# Altium schematic sheet LVDS_Splitter.SchDoc
size A3; Organization: Altium Limited; Address1: L3, 12a Rodborough Rd; Address2: Frenchs Forest; Address3: NSW; Address4: Australia 2086
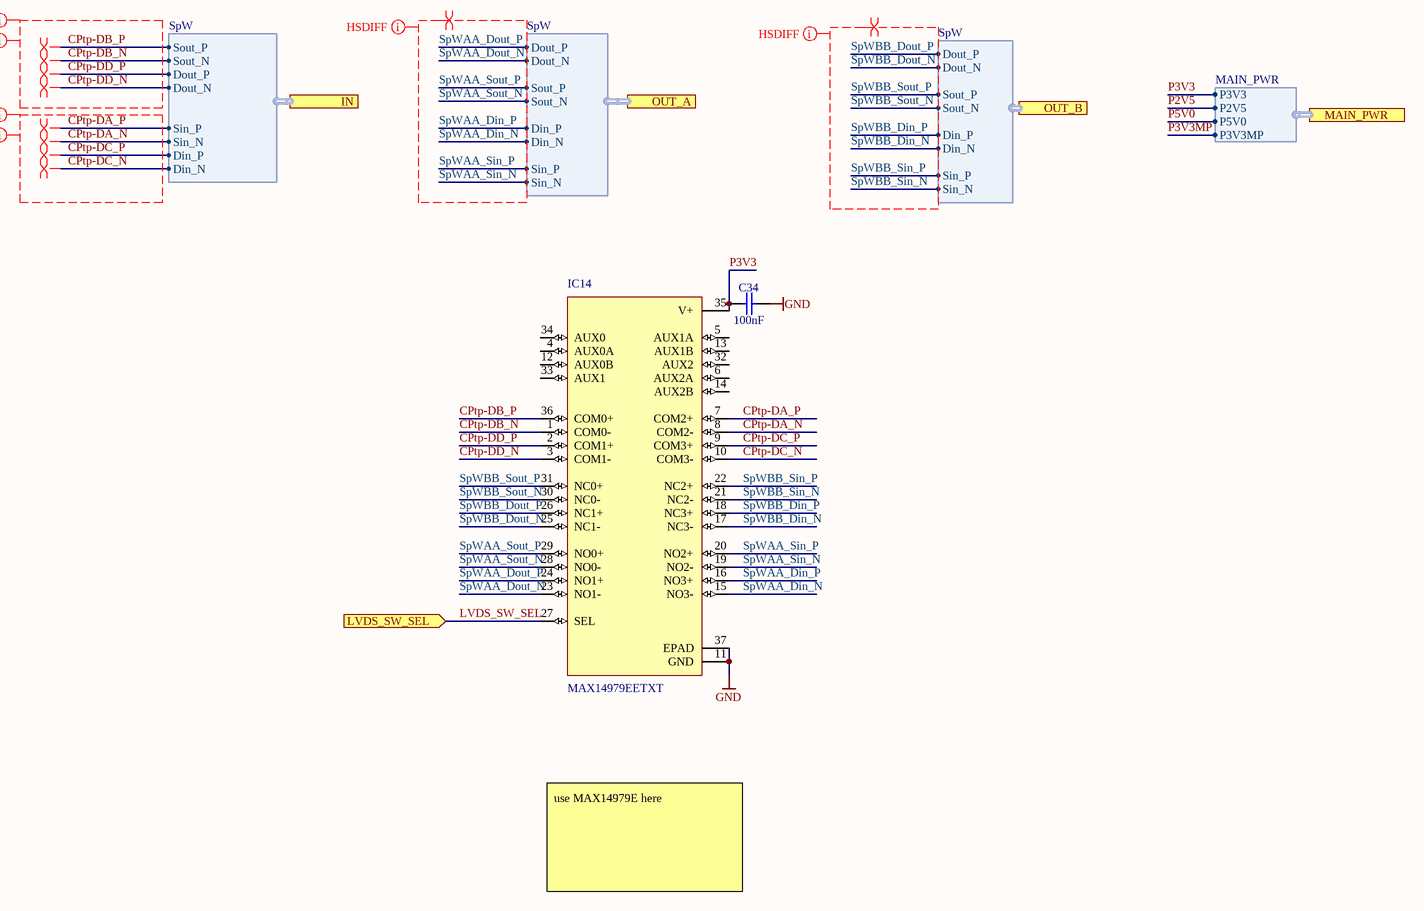
[diagram p0: LVDS_Splitter.SchDoc]

## Parts
C34  100nF  [CAPC0603X33N]
IC14  MAX14979EETXT  [QFN50P600X600X90-37N-S425]

## Ports
IN (harness SpW), LVDS_SW_SEL (in), MAIN_PWR (harness MAIN_PWR), OUT_A (harness SpW), OUT_B (harness SpW)

## Harnesses
MAIN_PWR: P3V3, P2V5, P5V0, P3V3MP
SpW: Sout_P, Sout_N, Dout_P, Dout_N, Sin_P, Sin_N, Din_P, Din_N

## Nets
GND: C34.2 IC14.11(GND) IC14.37(EPAD)
CPtp-DA_N: IC14.8(COM2-) ; port IN.Sin_N
CPtp-DA_P: IC14.7(COM2+) ; port IN.Sin_P
CPtp-DB_N: IC14.1(COM0-) ; port IN.Sout_N
CPtp-DB_P: IC14.36(COM0+) ; port IN.Sout_P
CPtp-DC_N: IC14.10(COM3-) ; port IN.Din_N
CPtp-DC_P: IC14.9(COM3+) ; port IN.Din_P
CPtp-DD_N: IC14.3(COM1-) ; port IN.Dout_N
CPtp-DD_P: IC14.2(COM1+) ; port IN.Dout_P
LVDS_SW_SEL: IC14.27(SEL) ; port LVDS_SW_SEL
P2V5: port MAIN_PWR.P2V5
P3V3: C34.1 IC14.35(V+) ; port MAIN_PWR.P3V3
P3V3MP: port MAIN_PWR.P3V3MP
P5V0: port MAIN_PWR.P5V0
SpWAA_Din_N: IC14.15(NO3-) ; port OUT_A.Din_N
SpWAA_Din_P: IC14.16(NO3+) ; port OUT_A.Din_P
SpWAA_Dout_N: IC14.23(NO1-) ; port OUT_A.Dout_N
SpWAA_Dout_P: IC14.24(NO1+) ; port OUT_A.Dout_P
SpWAA_Sin_N: IC14.19(NO2-) ; port OUT_A.Sin_N
SpWAA_Sin_P: IC14.20(NO2+) ; port OUT_A.Sin_P
SpWAA_Sout_N: IC14.28(NO0-) ; port OUT_A.Sout_N
SpWAA_Sout_P: IC14.29(NO0+) ; port OUT_A.Sout_P
SpWBB_Din_N: IC14.17(NC3-) ; port OUT_B.Din_N
SpWBB_Din_P: IC14.18(NC3+) ; port OUT_B.Din_P
SpWBB_Dout_N: IC14.25(NC1-) ; port OUT_B.Dout_N
SpWBB_Dout_P: IC14.26(NC1+) ; port OUT_B.Dout_P
SpWBB_Sin_N: IC14.21(NC2-) ; port OUT_B.Sin_N
SpWBB_Sin_P: IC14.22(NC2+) ; port OUT_B.Sin_P
SpWBB_Sout_N: IC14.30(NC0-) ; port OUT_B.Sout_N
SpWBB_Sout_P: IC14.31(NC0+) ; port OUT_B.Sout_P

Not connected (* = marked no-connect by the designer): IC14 4(AUX0A) 5(AUX1A) 6(AUX2A) 12(AUX0B) 13(AUX1B) 14(AUX2B) 32(AUX2) 33(AUX1) 34(AUX0)

## Layout directives
differential pair: CPtp-DA_N, CPtp-DA_P, CPtp-DB_N, CPtp-DB_P, CPtp-DC_N, CPtp-DC_P, CPtp-DD_N, CPtp-DD_P, SpWAA_Din_N, SpWAA_Din_P, SpWAA_Dout_N, SpWAA_Dout_P, SpWAA_Sin_N, SpWAA_Sin_P, SpWAA_Sout_N, SpWAA_Sout_P, SpWBB_Din_N, SpWBB_Din_P, SpWBB_Dout_N, SpWBB_Dout_P, SpWBB_Sin_N, SpWBB_Sin_P, SpWBB_Sout_N, SpWBB_Sout_P
net class SpW_02_out: CPtp-DB_N, CPtp-DB_P, CPtp-DD_N, CPtp-DD_P
net class SpW_02_in: CPtp-DA_N, CPtp-DA_P, CPtp-DC_N, CPtp-DC_P
net class HSDIFF: CPtp-DA_N, CPtp-DA_P, CPtp-DB_N, CPtp-DB_P, CPtp-DC_N, CPtp-DC_P, CPtp-DD_N, CPtp-DD_P, SpWAA_Din_N, SpWAA_Din_P, SpWAA_Dout_N, SpWAA_Dout_P, SpWAA_Sin_N, SpWAA_Sin_P, SpWAA_Sout_N, SpWAA_Sout_P, SpWBB_Din_N, SpWBB_Din_P, SpWBB_Dout_N, SpWBB_Dout_P, SpWBB_Sin_N, SpWBB_Sin_P, SpWBB_Sout_N, SpWBB_Sout_P

## Notes on the sheet
- use MAX14979E here
- Title
- Size:
- Date:
- A3
- Number:
- Time:
- Revision:
- Sheet
- of
- File:

## Library data of the parts
C34 = CC0201_100NF_6.3V_10%_X5R: Non-polarised capacitor; Manufacturer: GENERIC; Part Description: SMD Multilayer Chip Ceramic Capacitor; Manufacturer1 Part Number: 02016D104KAT2A; Tolerance: ±10%; Voltage: 6.3V; TC: X5R; Part Number: CC0201_100NF_6.3V_10%_X5R; Component Kind: Standard; Component Type: Standard; Pin Count: 2; Value: 100nF; Status: Not Recommended; Manufacturer Part Number: CC0201_100NF_6.3V_10%_X5R; Case: 0201; Mounted: Yes; Socket: No; SMD: Yes; Sense: No; Manufacturer1 Example: AVX; Manufacturer1 ComponentHeight: 0.33mm; HelpURL: \\cern.ch\dfs\Applications\Altium\Datasheets\CC0201_X5R_AVX.pdf; Author: CERN DEM JLC; CreateDate: 03/12/2007; LatestRevisionDate: 03/12/2007
IC14 = MAX14979EETXT: IC SWITCH HIGH BW LVDS 36TQFN; MF: Maxim Integrated; MP: MAX14979EETX+; SnapEDA_Link: https://www.snapeda.com/parts/MAX14979EETX%2B/Maxim%20Integrated/view-part/?ref=snap; Price: None; Package: QFN-36 Maxim; Availability: Unavailable; Value: *